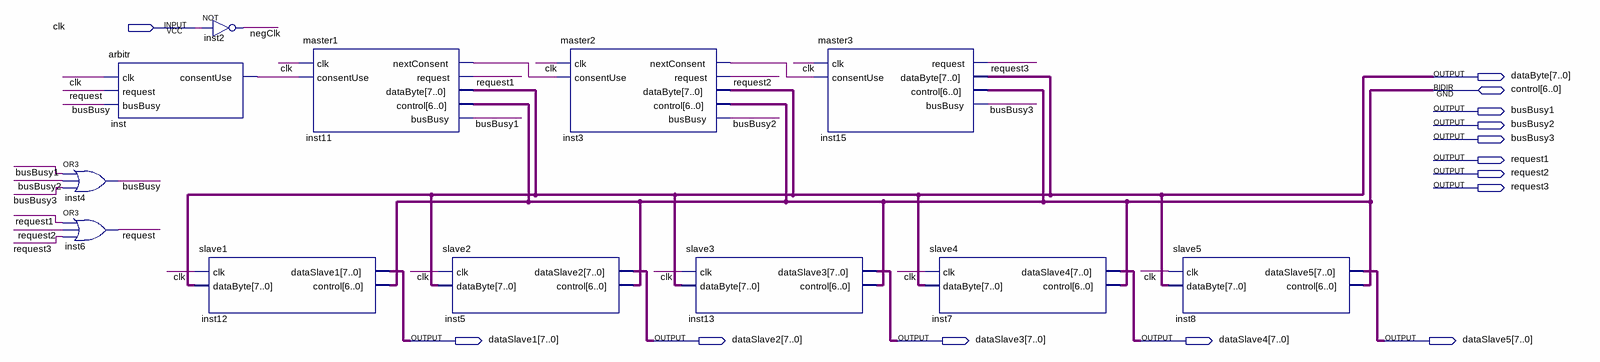
[diagram p0: schematic sheet]
// Quartus schematic Main.bdf as structural Verilog: 12 symbols, 14 pins
module Main (
  input  clk,
  inout  [6:0] control,
  output [7:0] dataByte,
  output busBusy1,
  output busBusy2,
  output busBusy3,
  output request1,
  output request2,
  output request3,
  output [7:0] dataSlave1,
  output [7:0] dataSlave2,
  output [7:0] dataSlave3,
  output [7:0] dataSlave4,
  output [7:0] dataSlave5
);

  wire busBusy, inst3_nextconsent, inst11_nextconsent, inst_consentuse, negClk, request;

  or inst4 (busBusy, busBusy1, busBusy2, busBusy3);
  or inst6 (request, request1, request2, request3);
  arbitr inst (.clk(clk), .request(request), .busBusy(busBusy), .consentUse(inst_consentuse));
  not inst2 (negClk, clk);
  slave1 inst12 (.clk(clk), .dataByte(dataByte), .dataSlave1(dataSlave1), .control(control));
  master1 inst11 (
    .clk(clk), .consentUse(inst_consentuse), .nextConsent(inst11_nextconsent), .request(request1),
    .dataByte(dataByte), .busBusy(busBusy1), .control(control));
  slave2 inst5 (.clk(clk), .dataByte(dataByte), .dataSlave2(dataSlave2), .control(control));
  master2 inst3 (
    .clk(clk), .consentUse(inst11_nextconsent), .nextConsent(inst3_nextconsent), .request(request2),
    .dataByte(dataByte), .busBusy(busBusy2), .control(control));
  slave3 inst13 (.clk(clk), .dataByte(dataByte), .dataSlave3(dataSlave3), .control(control));
  master3 inst15 (
    .clk(clk), .consentUse(inst3_nextconsent), .request(request3), .dataByte(dataByte), .busBusy(busBusy3),
    .control(control));
  slave4 inst7 (.clk(clk), .dataByte(dataByte), .dataSlave4(dataSlave4), .control(control));
  slave5 inst8 (.clk(clk), .dataByte(dataByte), .dataSlave5(dataSlave5), .control(control));
endmodule
